# EAGLE design mLRS-tx-dualE28-top-v042 (EAGLE 7.5.0)
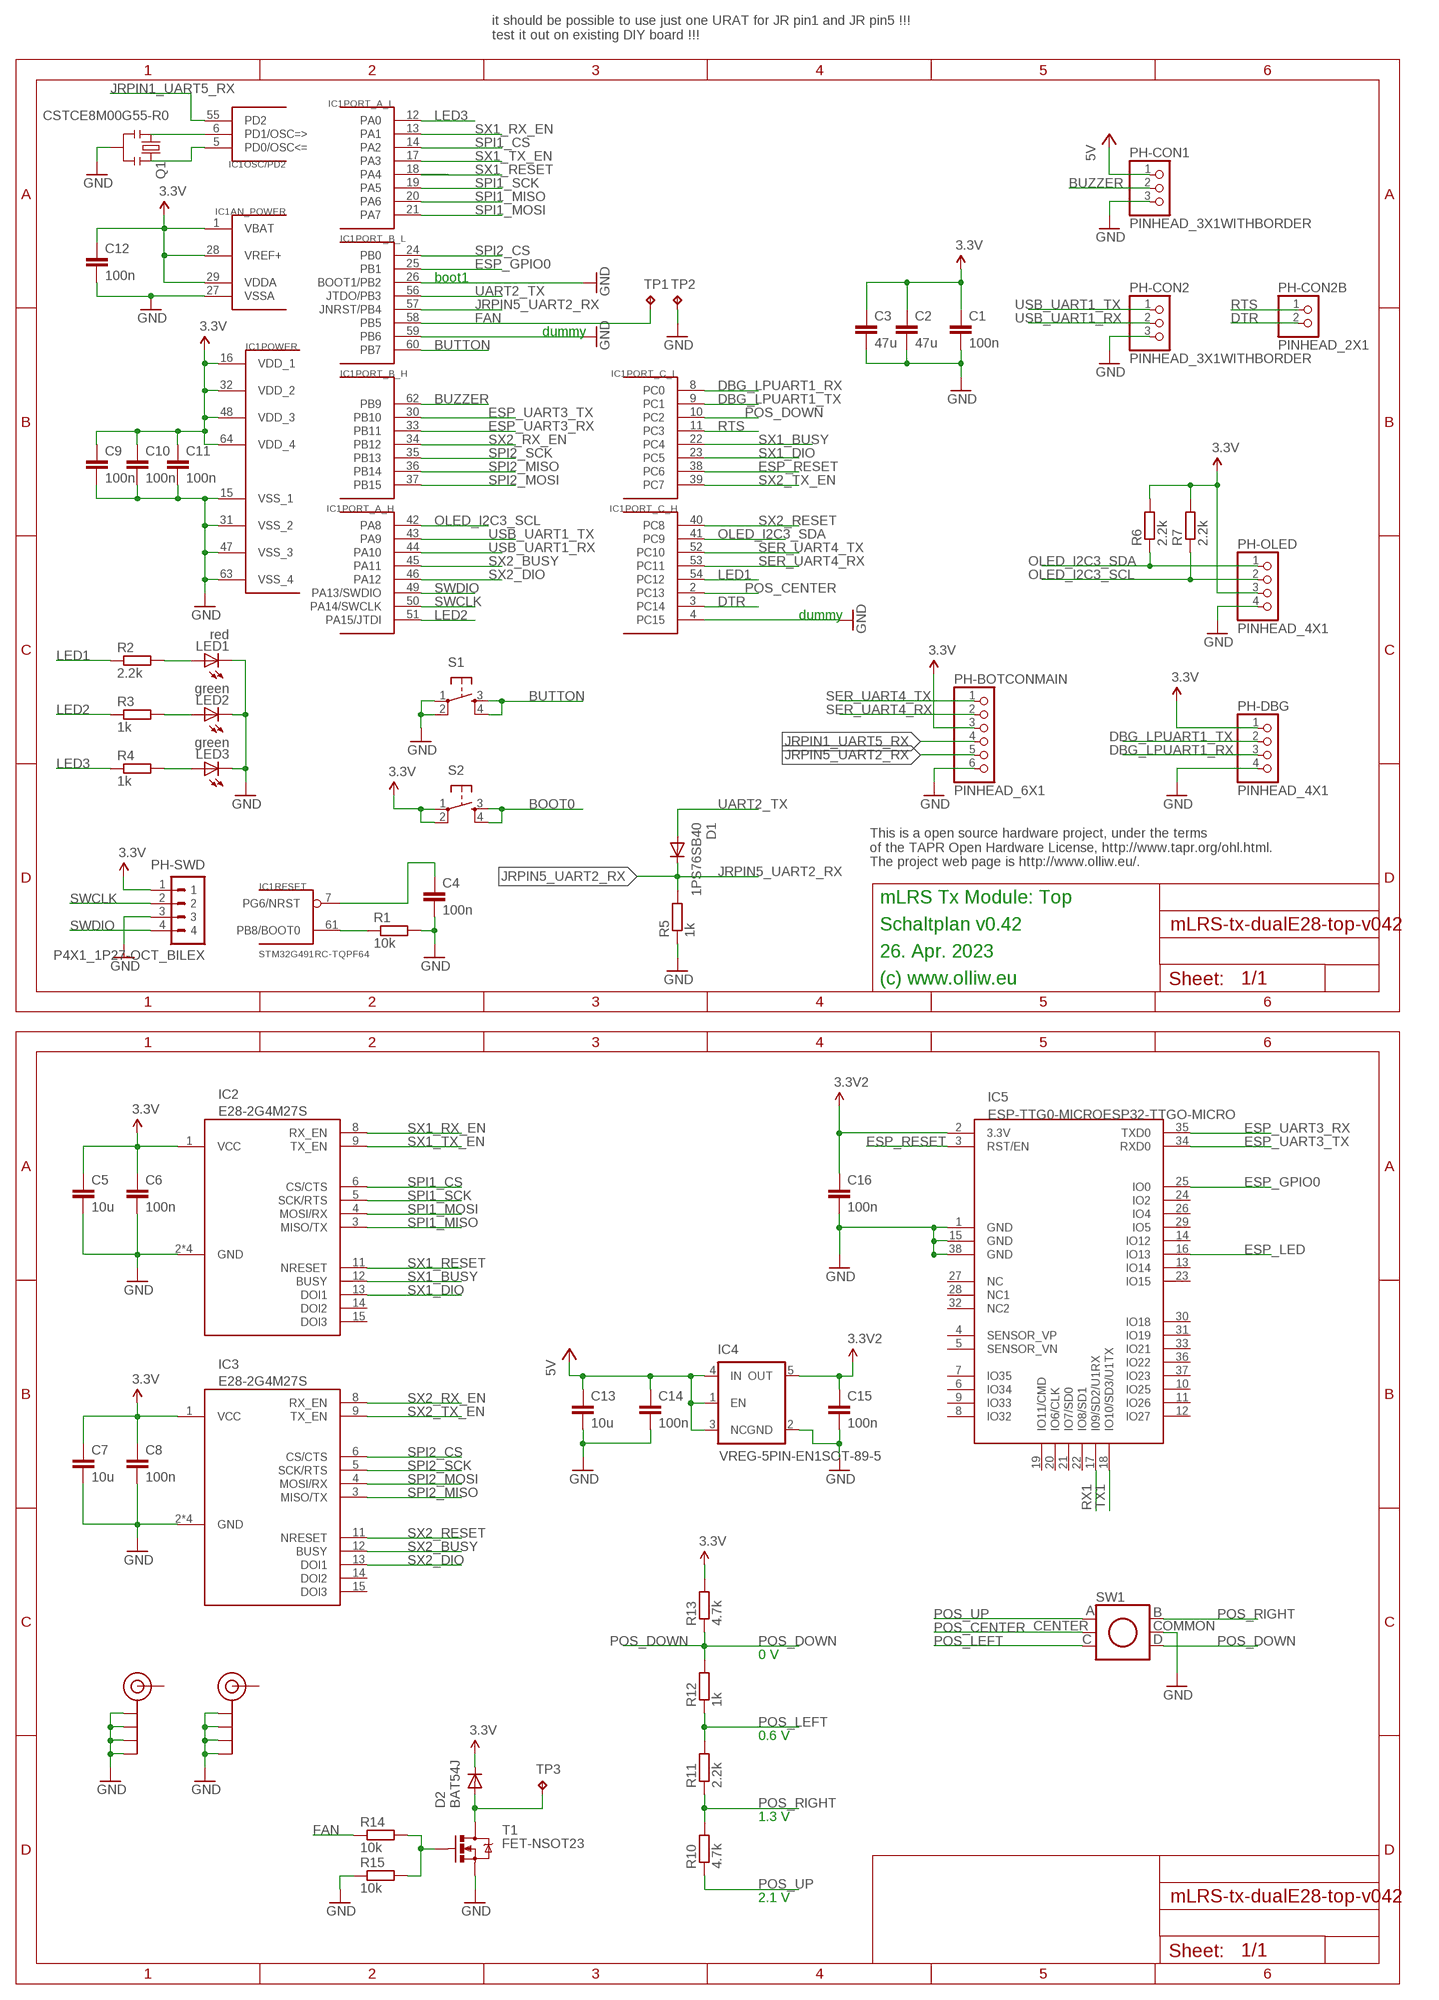
[diagram p0: schematic, sheet 1]

## Parts
C1  100n  C-EUC0402  [C0402]
C2  47u  C-EUC1210  [C1210]
C3  47u  C-EUC1206K  [C1206K]
C4  100n  C-EUC0402  [C0402]
C5  10u  C-EUC0603  [C0603]
C6  100n  C-EUC0402  [C0402]
C7  10u  C-EUC0603  [C0603]
C8  100n  C-EUC0402  [C0402]
C9  100n  C-EUC0402  [C0402]
C10  100n  C-EUC0402  [C0402]
C11  100n  C-EUC0402  [C0402]
C12  100n  C-EUC0402  [C0402]
C13  10u  C-EUC0603  [C0603]
C14  100n  C-EUC0402  [C0402]
C15  100n  C-EUC0402  [C0402]
C16  100n  C-EUC0603  [C0603]
D1  1PS76SB40  DIODE-SOD110-R  [SOD110-R]
D2  BAT54J  DIODE-SOD110-R  [SOD110-R]
IC1  STM32G491RC-TQPF64  STM32G4X1RX-TQPF64  [TQFP64]
IC2  E28-2G4M27S  E28  [E28-2G4M27]
IC3  E28-2G4M27S  E28  [E28-2G4M27]
IC4  VREG-5PIN-EN1SOT-89-5  [SOT-89-5]
IC5  ESP-TTG0-MICROESP32-TTGO-MICRO  [ESP32-TTGO-MICRO]
LED1  red  LEDCHIPLED_0603  [CHIPLED_0603]
LED2  green  LEDCHIPLED_0603  [CHIPLED_0603]
LED3  green  LEDCHIPLED_0603  [CHIPLED_0603]
PH-BOTCONMAIN  PINHEAD_6X1  [PINHEAD_6X1]
PH-CON1  PINHEAD_3X1WITHBORDER  [PINHEAD_3X1]
PH-CON2  PINHEAD_3X1WITHBORDER  [PINHEAD_3X1]
PH-CON2B  PINHEAD_2X1  [PINHEAD_2X1]
PH-DBG  PINHEAD_4X1  [PINHEAD_4X1]
PH-OLED  PINHEAD_4X1  [PINHEAD_4X1]
PH-SWD  P4X1_1P27-OCT_BILEX  [4X1_1P27_OCT_BILEX]
Q1  CSTCE8M00G55-R0  RESONATORSMD  [RESONATOR-SMD]
R1  10k  R-EU_R0402  [R0402]
R2  2.2k  R-EU_R0402  [R0402]
R3  1k  R-EU_R0402  [R0402]
R4  1k  R-EU_R0402  [R0402]
R5  1k  R-EU_R0402  [R0402]
R6  2.2k  R-EU_R0402  [R0402]
R7  2.2k  R-EU_R0402  [R0402]
R10  4.7k  R-EU_R0402  [R0402]
R11  2.2k  R-EU_R0402  [R0402]
R12  1k  R-EU_R0402  [R0402]
R13  4.7k  R-EU_R0402  [R0402]
R14  10k  R-EU_R0402  [R0402]
R15  10k  R-EU_R0402  [R0402]
RF1  SMA_EDGE  [SMA-EDGE]
RF2  SMA_EDGE  [SMA-EDGE]
S1  TAC_SWITCHPTH  [TACTILE-PTH]
S2  TAC_SWITCHPTH  [TACTILE-PTH]
SW1  JOYSTICK-5WAY  [JOYSTICK-5WAY]
T1  FET-NSOT23  [SOT23]
TP1  TPB1,27  [B1,27]
TP2  TPB1,27  [B1,27]
TP3  TPB1,27  [B1,27]

## Nets
2.8V: C15.1 C16.1 IC4.5(OUT) IC5.2(3.3V) ; supply symbol labelled 3.3V2
3.3V: C1.1 C2.1 C3.1 C5.1 C6.1 C7.1 C8.1 C9.1 C10.1 C11.1 C12.1 D2.C IC1.1(AN_POWER:VBAT) IC1.16(POWER:VDD_1) IC1.28(AN_POWER:VREF+) IC1.29(AN_POWER:VDDA) IC1.32(POWER:VDD_2) IC1.48(POWER:VDD_3) IC1.64(POWER:VDD_4) IC2.1(VCC) IC3.1(VCC) PH-BOTCONMAIN.3 PH-DBG.1 PH-OLED.3 PH-SWD.1 R6.2 R7.2 R13.2 S2.1 S2.2
5V: C13.1 C14.1 IC4.1(EN) IC4.3(NC) IC4.4(IN) PH-CON1.1
BOOT0: IC1.61(RESET:PB8/BOOT0) R1.1 S2.3 S2.4
BUTTON: IC1.60(PORT_B_L:PB7) S1.3 S1.4
BUZ-: D2.A T1.3(D) TP3.TP
BUZZER: IC1.62(PORT_B_H:PB9) PH-CON1.2
DBG_LPUART1_RX: IC1.8(PORT_C_L:PC0) PH-DBG.3
DBG_LPUART1_TX: IC1.9(PORT_C_L:PC1) PH-DBG.2
DTR: IC1.3(PORT_C_H:PC14) PH-CON2B.2
ESP_GPIO0: IC1.25(PORT_B_L:PB1) IC5.25(IO0)
ESP_LED: IC5.16(IO13)
ESP_RESET: IC1.38(PORT_C_L:PC6) IC5.3(RST/EN)
ESP_UART3_RX: IC1.33(PORT_B_H:PB11) IC5.35(TXD0)
ESP_UART3_TX: IC1.30(PORT_B_H:PB10) IC5.34(RXD0)
FAN: IC1.58(PORT_B_L:PB5) R14.1 TP1.TP
GND: C1.2 C2.2 C3.2 C4.2 C5.2 C6.2 C7.2 C8.2 C9.2 C10.2 C11.2 C12.2 C13.2 C14.2 C15.2 C16.2 IC1.4(PORT_C_H:PC15) IC1.15(POWER:VSS_1) IC1.26(PORT_B_L:BOOT1/PB2) IC1.27(AN_POWER:VSSA) IC1.31(POWER:VSS_2) IC1.47(POWER:VSS_3) IC1.59(PORT_B_L:PB6) IC1.63(POWER:VSS_4) IC2.2(GND) IC2.7(GND) IC2.10(GND) IC2.16(GND) IC3.2(GND) IC3.7(GND) IC3.10(GND) IC3.16(GND) IC4.2(GND) IC5.1(GND) IC5.15(GND) IC5.38(GND) LED1.C LED2.C LED3.C PH-BOTCONMAIN.6 PH-CON1.3 PH-CON2.3 PH-DBG.4 PH-OLED.4 PH-SWD.3 Q1.2 R1.2 R5.1 R15.1 RF1.GND@0(GND) RF1.GND@1(GND) RF1.GND@2(GND) RF1.GND@3(GND) RF2.GND@0(GND) RF2.GND@1(GND) RF2.GND@2(GND) RF2.GND@3(GND) S1.1 S1.2 SW1.5(COMMON) T1.2(S) TP2.TP
JRPIN1_UART5_RX: IC1.55(OSC/PD2:PD2) PH-BOTCONMAIN.4
JRPIN5_UART2_RX: D1.C IC1.57(PORT_B_L:JNRST/PB4) PH-BOTCONMAIN.5 R5.2
LED1: IC1.54(PORT_C_H:PC12) R2.1
LED2: IC1.51(PORT_A_H:PA15/JTDI) R3.1
LED3: IC1.12(PORT_A_L:PA0) R4.1
N$2: R14.2 R15.2 T1.1(G)
N$4: LED1.A R2.2
N$5: C4.1 IC1.7(RESET:PG6/NRST)
N$8: LED2.A R3.2
N$9: LED3.A R4.2
N$12: IC1.5(OSC/PD2:PD0/OSC<=) Q1.3
N$14: IC1.6(OSC/PD2:PD1/OSC=>) Q1.1
OLED_I2C3_SCL: IC1.42(PORT_A_H:PA8) PH-OLED.2 R7.1
OLED_I2C3_SDA: IC1.41(PORT_C_H:PC9) PH-OLED.1 R6.1
POS_CENTER: IC1.2(PORT_C_H:PC13) SW1.2(CENTER)
POS_DOWN: IC1.10(PORT_C_L:PC2) R12.2 R13.1 SW1.6(D)
POS_LEFT: R11.2 R12.1 SW1.3(C)
POS_RIGHT: R10.2 R11.1 SW1.4(B)
POS_UP: R10.1 SW1.1(A)
RTS: IC1.11(PORT_C_L:PC3) PH-CON2B.1
RX1: IC5.17(I09/SD2/U1RX)
SER_UART4_RX: IC1.53(PORT_C_H:PC11) PH-BOTCONMAIN.2
SER_UART4_TX: IC1.52(PORT_C_H:PC10) PH-BOTCONMAIN.1
SPI1_CS: IC1.14(PORT_A_L:PA2) IC2.6(CS/CTS)
SPI1_MISO: IC1.20(PORT_A_L:PA6) IC2.3(MISO/TX)
SPI1_MOSI: IC1.21(PORT_A_L:PA7) IC2.4(MOSI/RX)
SPI1_SCK: IC1.19(PORT_A_L:PA5) IC2.5(SCK/RTS)
SPI2_CS: IC1.24(PORT_B_L:PB0) IC3.6(CS/CTS)
SPI2_MISO: IC1.36(PORT_B_H:PB14) IC3.3(MISO/TX)
SPI2_MOSI: IC1.37(PORT_B_H:PB15) IC3.4(MOSI/RX)
SPI2_SCK: IC1.35(PORT_B_H:PB13) IC3.5(SCK/RTS)
SWCLK: IC1.50(PORT_A_H:PA14/SWCLK) PH-SWD.2
SWDIO: IC1.49(PORT_A_H:PA13/SWDIO) PH-SWD.4
SX1_BUSY: IC1.22(PORT_C_L:PC4) IC2.12(BUSY)
SX1_DIO: IC1.23(PORT_C_L:PC5) IC2.13(DOI1)
SX1_RESET: IC1.18(PORT_A_L:PA4) IC2.11(NRESET)
SX1_RX_EN: IC1.13(PORT_A_L:PA1) IC2.8(RX_EN)
SX1_TX_EN: IC1.17(PORT_A_L:PA3) IC2.9(TX_EN)
SX2_BUSY: IC1.45(PORT_A_H:PA11) IC3.12(BUSY)
SX2_DIO: IC1.46(PORT_A_H:PA12) IC3.13(DOI1)
SX2_RESET: IC1.40(PORT_C_H:PC8) IC3.11(NRESET)
SX2_RX_EN: IC1.34(PORT_B_H:PB12) IC3.8(RX_EN)
SX2_TX_EN: IC1.39(PORT_C_L:PC7) IC3.9(TX_EN)
TX1: IC5.18(IO10/SD3/U1TX)
UART2_TX: D1.A IC1.56(PORT_B_L:JTDO/PB3)
USB_UART1_RX: IC1.44(PORT_A_H:PA10) PH-CON2.2
USB_UART1_TX: IC1.43(PORT_A_H:PA9) PH-CON2.1
Unconnected: IC2.14(DOI2) IC2.15(DOI3) IC3.14(DOI2) IC3.15(DOI3) IC5.4(SENSOR_VP) IC5.5(SENSOR_VN) IC5.6(IO34) IC5.7(IO35) IC5.8(IO32) IC5.9(IO33) IC5.10(IO25) IC5.11(IO26) IC5.12(IO27) IC5.13(IO14) IC5.14(IO12) IC5.19(IO11/CMD) IC5.20(IO6/CLK) IC5.21(IO7/SD0) IC5.22(IO8/SD1) IC5.23(IO15) IC5.24(IO2) IC5.26(IO4) IC5.27(NC) IC5.28(NC1) IC5.29(IO5) IC5.30(IO18) IC5.31(IO19) IC5.32(NC2) IC5.33(IO21) IC5.36(IO22) IC5.37(IO23) RF1.SIG(SIGNAL) RF2.SIG(SIGNAL)

## Notes on the sheet
- it should be possible to use just one URAT for JR pin1 and JR pin5 !!!
  test it out on existing DIY board !!!
- boot1
- dummy
- dummy
- This is a open source hardware project, under the terms
  of the TAPR Open Hardware License, http://www.tapr.org/ohl.html.
  The project web page is http://www.olliw.eu/.
- mLRS Tx Module: Top
- Schaltplan v0.42
- 26. Apr. 2023
- (c) www.olliw.eu
- 0 V
- 0.6 V
- 1.3 V
- 2.1 V

## Library data of the parts
C1-C16 = rcl:C-EU: CAPACITOR, European symbol
D1 D2 = diode:DIODE-: DIODE
IC1 = # stm32:STM32G4X1RX
IC2 IC3 = # stdlib:E28
IC4 = # stdlib:VREG-5PIN-EN1
IC5 = # stdlib:ESP-TTG0-MICRO
LED1-LED3 = led:LED: LED OSRAM: - CHIPLED LG R971, LG N971, LY N971, LG Q971, LY Q971, LO R971, LY R971 LH N974, LH R974 LS Q976, LO Q976, LY Q976 LO Q996 - Hyper CHIPLED LW Q18S LB Q993, LB Q99A, LB R99A - SideLED LS A670, LO A670, LY A670, LG A670, LP A670 LB A673, LV A673, LT A673, LW A673 LH A674 LY A675 LS A676, LA A676, LO A676, LY A676, LW A676 LS A679, LY A679, LG A679 - Hyper Micro SIDELED® LS Y876, LA Y876, LO Y876, LY Y876 LT Y87S - SmartLED LW L88C, LW L88S LB L89C, LB L89S, LG L890 LS L89K, LO L89K, LY L89K LS L896, LA L896, LO L896, LY L896 - TOPLED LS T670, LO T670, LY T670, LG T670, LP T670 LSG T670, LSP T670, LSY T670, LOP T670, LYG T670 LG T671, LOG T671, LSG T671 LB T673, LV T673, LT T673, LW T673 LH T674 LS T676, LA T676, LO T676, LY T676, LB T676, LH T676, LSB T676, LW T676 LB T67C, LV T67C, LT T67C, LS T67K, LO T67K, LY T67K, LW E67C LS E67B, LA E67B, LO E67B, LY E67B, LB E67C, LV E67C, LT E67C LW T67C LS T679, LY T679, LG T679 LS T770, LO T770, LY T770, LG T770, LP T770 LB T773, LV T773, LT T773, LW T773 LH T774 LS E675, LA E675, LY E675, LS T675 LS T776, LA T776, LO T776, LY T776, LB T776 LHGB T686 LT T68C, LB T68C - Hyper Mini TOPLED® LB M676 - Mini TOPLED Santana® LG M470 LS M47K, LO M47K, LY M47K Source: http://www.osram.convergy.de LUXEON: - LUMILED® LXK2-PW12-R00, LXK2-PW12-S00, LXK2-PW14-U00, LXK2-PW14-V00 LXK2-PM12-R00, LXK2-PM12-S00, LXK2-PM14-U00 LXK2-PE12-Q00, LXK2-PE12-R00, LXK2-PE12-S00, LXK2-PE14-T00, LXK2-PE14-U00 LXK2-PB12-K00, LXK2-PB12-L00, LXK2-PB12-M00, LXK2-PB14-N00, LXK2-PB14-P00, LXK2-PB14-Q00 LXK2-PR12-L00, LXK2-PR12-M00, LXK2-PR14-Q00, LXK2-PR14-R00 LXK2-PD12-Q00, LXK2-PD12-R00, LXK2-PD12-S00 LXK2-PH12-R00, LXK2-PH12-S00 LXK2-PL12-P00, LXK2-PL12-Q00, LXK2-PL12-R00 Source: www.luxeon.com KINGBRIGHT: KA-3528ASYC Source: www.kingbright.com
PH-BOTCONMAIN = # stdlib:PINHEAD_6X1
PH-CON1 PH-CON2 = # stdlib:PINHEAD_3X1
PH-CON2B = # stdlib:PINHEAD_2X1
PH-DBG PH-OLED = # stdlib:PINHEAD_4X1
PH-SWD = # stdlib:P4X1_1P27
Q1 = # SparkFun2:RESONATOR: Resonator Small SMD resonator. This is the itty bitty 10/20MHz resonators with built in caps. CSTCE10M0G55 and CSTCE20M0V53. Footprint has been reviewed closely but hasn't been tested yet.
R1-R7 R10-R15 = rcl:R-EU_: RESISTOR, European symbol
RF1 RF2 = # SparkFun2:SMA_EDGE: SMA Antenna Connector End launch SMA connector. The paste layer has been removed so that the connector can be hand soldered onto the board after reflow.
S1 S2 = # SparkFun2:TAC_SWITCH: Momentary Switch Button commonly used for reset or general input. Spark Fun Electronics SKU : COM-00097
SW1 = # stdlib:JOYSTICK-5WAY
T1 = # stdlib:FET-N
TP1-TP3 = testpad:TP: Test pad

## Board
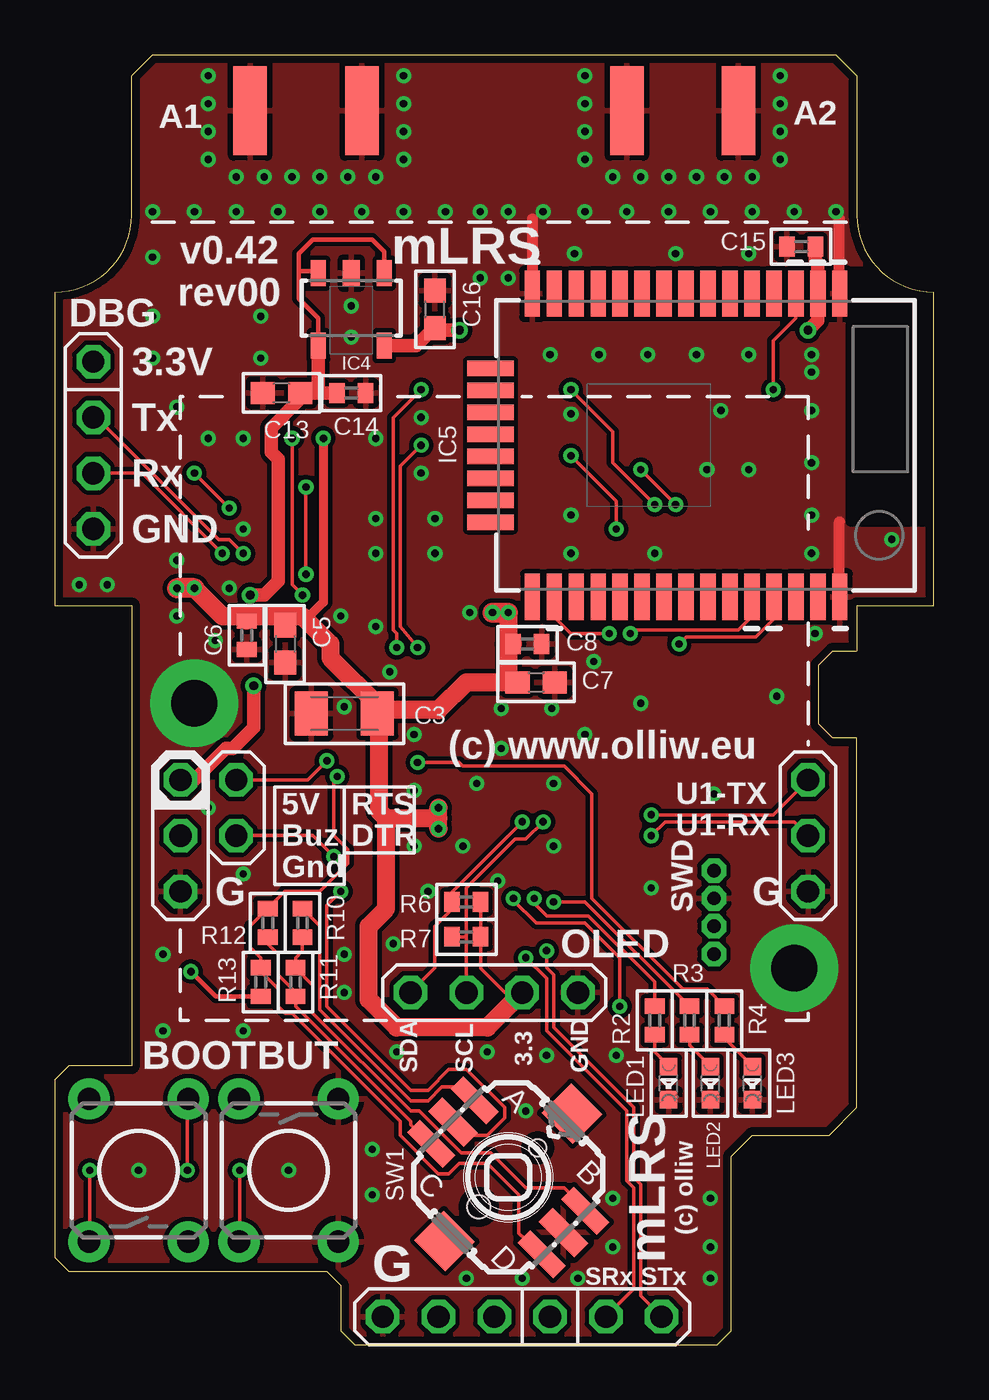
[diagram p1: board, top side]
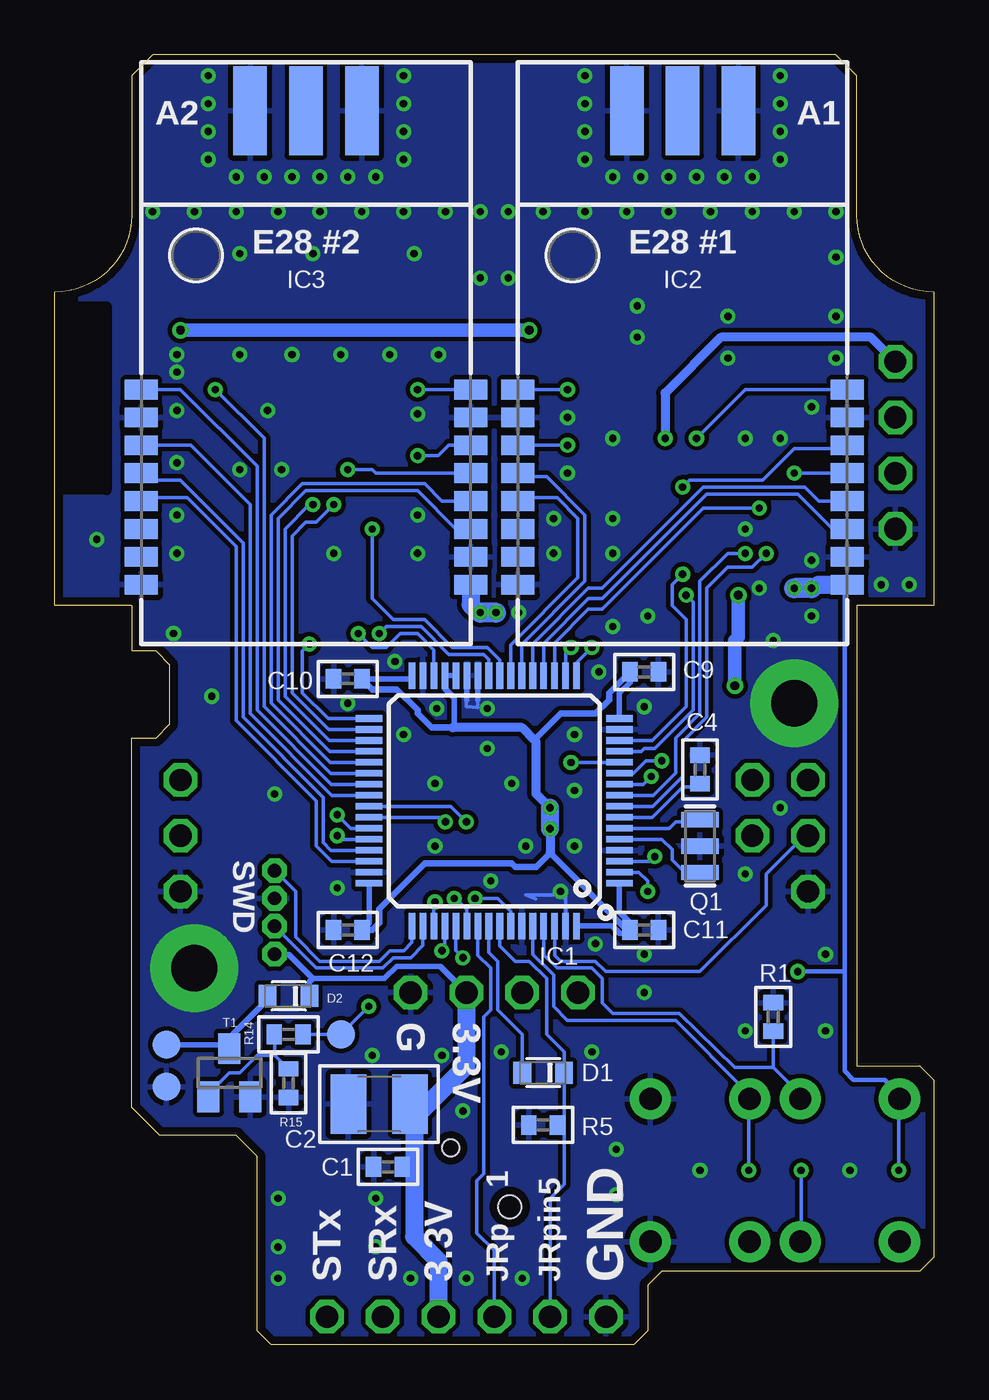
[diagram p2: board, bottom side, seen from below]

Size 40.01 x 58.74 mm. Coordinates in mm from the lower left corner, seen from the top.
Outline: 36.51,10.79 36.51,27.62 35.4,27.62 34.77,28.26 34.77,30.96 35.4,31.59 36.51,31.59 36.51,33.66 40.01,33.66 40.01,47.94 arc-90 36.51,51.44 36.51,57.78 35.56,58.74 4.45,58.74 3.49,57.78 3.49,51.44 arc-90 0,47.94 0,33.66 3.49,33.66 3.49,12.7 0.64,12.7 0,12.07 0,3.97 0.64,3.33 12.38,3.33 13.02,2.7 13.02,0.63 13.65,0 30.16,0 30.8,0.63 30.8,8.57 31.75,9.53 35.24,9.53 36.51,10.79
Copper layers (1*16): Top 0.0356mm / dielectric 1.5011mm / Bottom 0.0356mm
Design rules "ow-oshpark-2layer": minimum track width 6mil, minimum drill 13mil, track to track 6mil, track to pad 6mil, pad to pad 6mil, via to via 6mil, smd to smd 6mil, copper to edge 15mil, drill to drill 6mil, minimum pad ring 7mil, minimum via ring 7mil, stop-mask expansion 2.5mil, vias tented up to drill 26mil, thermal gap 10mil
tRestrict: area 36.2,37.5 to 40.6,48.9
bRestrict: area 37.6,38.9 to 41.3,47.3

### Footprints (pad centres in the part's own frame; a part is rotated, then mirrored left to right if it is on the bottom)
C0402 = smd 0.7 x 0.9: 1 -0.65,0; 2 0.65,0
C1210 = smd 1.6 x 2.7: 1 -1.4,0; 2 1.4,0
C1206K = smd 1.5 x 2: 1 -1.5,0; 2 1.5,0
C0603 = smd 1.1 x 1: 1 -0.85,0; 2 0.85,0
SOD110-R = smd 0.8 x 1: A 0.95,0; C -0.95,0
TQFP64 = smd 1.2 x 0.3: 1 -5.7,3.75; 2 -5.7,3.25; 3 -5.7,2.75; 4 -5.7,2.25; 5 -5.7,1.75; 6 -5.7,1.25; 7 -5.7,0.75; 8 -5.7,0.25; 9 -5.7,-0.25; 10 -5.7,-0.75; 11 -5.7,-1.25; 12 -5.7,-1.75; 13 -5.7,-2.25; 14 -5.7,-2.75; 15 -5.7,-3.25; 16 -5.7,-3.75; 33 5.7,-3.75; 34 5.7,-3.25; 35 5.7,-2.75; 36 5.7,-2.25; 37 5.7,-1.75; 38 5.7,-1.25; 39 5.7,-0.75; 40 5.7,-0.25; 41 5.7,0.25; 42 5.7,0.75; 43 5.7,1.25; 44 5.7,1.75; 45 5.7,2.25; 46 5.7,2.75; 47 5.7,3.25; 48 5.7,3.75 | smd 0.3 x 1.2: 17 -3.75,-5.7; 18 -3.25,-5.7; 19 -2.75,-5.7; 20 -2.25,-5.7; 21 -1.75,-5.7; 22 -1.25,-5.7; 23 -0.75,-5.7; 24 -0.25,-5.7; 25 0.25,-5.7; 26 0.75,-5.7; 27 1.25,-5.7; 28 1.75,-5.7; 29 2.25,-5.7; 30 2.75,-5.7; 31 3.25,-5.7; 32 3.75,-5.7; 49 3.75,5.7; 50 3.25,5.7; 51 2.75,5.7; 52 2.25,5.7; 53 1.75,5.7; 54 1.25,5.7; 55 0.75,5.7; 56 0.25,5.7; 57 -0.25,5.7; 58 -0.75,5.7; 59 -1.25,5.7; 60 -1.75,5.7; 61 -2.25,5.7; 62 -2.75,5.7; 63 -3.25,5.7; 64 -3.75,5.7
E28-2G4M27 = smd 1.5 x 0.9: 1 7.5,0; 2 7.5,1.27; 3 7.5,2.54; 4 7.5,3.81; 5 7.5,5.08; 6 7.5,6.35; 7 7.5,7.62; 8 7.5,8.89; 9 -7.5,8.89; 10 -7.5,7.62; 11 -7.5,6.35; 12 -7.5,5.08; 13 -7.5,3.81; 14 -7.5,2.54; 15 -7.5,1.27; 16 -7.5,0
SOT-89-5 = smd 0.68 x 1.2: 1 -1.5,-1.65; 3 1.5,-1.65; 4 1.5,1.65; 5 -1.5,1.65 | smd 0.76 x 1.2: 2 0,-1.65
ESP32-TTGO-MICRO = smd 2.1 x 0.7: 1 -6.9,7; 2 -6.9,6; 3 -6.9,5; 4 -6.9,4; 5 -6.9,3; 6 -6.9,2; 7 -6.9,1; 8 -6.9,0; 9 -6.9,-1; 10 -6.9,-2; 11 -6.9,-3; 12 -6.9,-4; 13 -6.9,-5; 14 -6.9,-6; 15 -6.9,-7; 24 6.9,-7; 25 6.9,-6; 26 6.9,-5; 27 6.9,-4; 28 6.9,-3; 29 6.9,-2; 30 6.9,-1; 31 6.9,0; 32 6.9,1; 33 6.9,2; 34 6.9,3; 35 6.9,4; 36 6.9,5; 37 6.9,6; 38 6.9,7 | smd 0.7 x 2.1: 16 -3.5,-8.9; 17 -2.5,-8.9; 18 -1.5,-8.9; 19 -0.5,-8.9; 20 0.5,-8.9; 21 1.5,-8.9; 22 2.5,-8.9; 23 3.5,-8.9
CHIPLED_0603 = smd 0.8 x 0.8: A 0,-0.75; C 0,0.75
PINHEAD_6X1 = drill 1.016 octagon: 1 0,12.7; 2 0,10.16; 3 0,7.62; 4 0,5.08; 5 0,2.54; 6 0,0
PINHEAD_3X1 = drill 1.016 octagon: 1 0,0; 2 0,-2.54; 3 0,-5.08
PINHEAD_2X1 = drill 1.016 octagon: 1 0,0; 2 0,-2.54
PINHEAD_4X1 = drill 1.016 octagon: 1 0,7.62; 2 0,5.08; 3 0,2.54; 4 0,0
4X1_1P27_OCT_BILEX = drill 0.61 pad 1.118 octagon: 1 0,0; 2 0,-1.27; 3 0,-2.54; 4 0,-3.81
RESONATOR-SMD = smd 0.7 x 1.7: 1 -1.2,0; 2 0,0; 3 1.2,0
R0402 = smd 0.7 x 0.9: 1 -0.65,0; 2 0.65,0
SMA-EDGE = smd 1.524 x 4.064: GND@0 0,0; GND@1 5.08,0; SIG 2.54,0 | smd 1.524 x 4.064 bottom: GND@2 0,0; GND@3 5.08,0
TACTILE-PTH = drill 1.016 pad 1.88: 1 -3.251,2.261; 2 3.251,2.261; 3 -3.251,-2.261; 4 3.251,-2.261
JOYSTICK-5WAY = smd 2.286 x 0.813: 1 -3.556,1.4; 3 -3.556,-1.4; 4 3.556,1.4; 6 3.556,-1.4 | smd 2.286 x 0.914: 2 -3.556,0; 5 3.556,0 | smd 2 x 1.9: S 0,4.1; T 0,-4.1 | hole 0.75: 0,1.9 | hole 1.05: 0,-1.9
SOT23 = smd 1 x 1.4: 1 -0.95,-1.1; 2 0.95,-1.1; 3 0,1.1
B1,27 = smd 1.27 x 1.27: TP 0,0

### Placement (x,y rotation side)
C1  24.84,8.1 180 bottom
C2  25.24,10.95 180 bottom
C3  13.18,28.73 180 top
C4  10.64,26.19 90 bottom
C5  10.48,31.91 270 top
C6  8.73,32.31 270 top
C7  21.91,30.16 0 top
C8  21.51,31.91 0 top
C9  13.18,30.64 0 bottom
C10  26.67,30.32 180 bottom
C11  13.18,18.89 0 bottom
C12  26.67,18.89 180 bottom
C13  10.32,43.34 180 top
C14  13.49,43.34 0 top
C15  33.97,50.01 180 top
C16  17.3,47.15 90 top
D1  17.78,12.38 180 bottom
D2  29.37,15.88 180 bottom
IC1  20,24.77 180 bottom
IC2  11.43,34.61 0 bottom
IC3  28.57,34.61 0 bottom
IC4  13.49,47.15 180 top
IC5  28.73,40.96 270 top
LED1  27.94,11.91 180 top
LED2  29.84,11.91 180 top
LED3  31.75,11.91 180 top
PH-BOTCONMAIN  14.92,1.27 270 top
PH-CON1  5.71,25.72 0 top
PH-CON2  34.29,25.72 0 top
PH-CON2B  8.26,25.72 0 top
PH-DBG  1.75,37.15 0 top
PH-OLED  23.81,16.03 90 top
PH-SWD  30,17.78 180 top
Q1  10.64,22.7 270 bottom
R1  7.3,14.92 90 bottom
R2  27.3,14.76 270 top
R3  28.89,14.76 270 top
R4  30.48,14.76 270 top
R5  17.78,10 0 bottom
R6  18.73,20.16 0 top
R7  18.73,18.57 0 top
R10  11.27,19.21 270 top
R11  10.95,16.51 270 top
R12  9.68,19.21 90 top
R13  9.37,16.51 270 top
R14  29.37,14.13 180 bottom
R15  29.37,11.91 90 bottom
RF1  13.97,56.2 0 bottom
RF2  31.11,56.2 0 bottom
S1  10.64,7.94 270 top
S2  3.81,7.94 90 top
SW1  20.64,7.62 315 top
T1  32.07,12.38 0 bottom
TP1  26.99,14.13 0 bottom
TP2  34.93,11.75 0 bottom
TP3  34.93,13.65 0 bottom

### Tracks (layer width: path | path; a pad name or v marks a point on that pad's centre or on a via)
2.8V  (via drill 0.4)
  Top 0.61: v34.29,46.2 34.73,46.64 IC5.2 34.73,49.24 34.61,49.37 34.61,49.99 C15.1 | IC4.5 16.45,45.5 16.99,46.04 17.04,46.04 C16.1 17.3,46.2 v18.41,46.2
  Bottom 0.61: v18.41,46.2 v34.29,46.2
3.3V  (via drill 0.33)
  Top 0.152: PH-OLED.3 20.48,16.03 19.38,17.13 R7.2 R6.2 | v1.59,7.94 1.59,4.72 S2.1
  Top 0.203: R13.2 7.32,15.86 v6.19,16.99
  Top 0.406: 10.48,32.92 C5.1 | v12.22,41.27 12.22,33.81 11.43,33.02
  Top 0.61: C3.1 14.52,28.65 14.76,29.05
  Top 0.813: PH-OLED.3 19.68,14.45 15.56,14.45 14.29,15.72 14.29,19.05 15.08,19.84 15.08,23.97 | 15.08,23.97 14.76,24.29 14.76,29.05 | 14.76,29.05 14.62,28.73 14.78,28.89 17.46,28.89 18.73,30.16 20.64,30.16 | 17.46,23.97 v17.46,24.45 | 8.89,33.18 7.62,33.18 v6.35,34.45 | 8.89,33.18 10.48,33.18 | 10.48,33.18 11.27,33.18 11.43,33.02 12.54,31.91 12.54,31.27 14.76,29.05 | C6.1 8.89,33.18 | C5.1 10.48,33.18 | v20.64,33.34 20.64,31.91 | 20.64,31.91 20.64,30.16 | C7.1 20.64,30.16 | C8.1 20.64,31.91 | v17.46,23.5 17.46,23.97 | 17.46,23.97 15.08,23.97
  Top 0.914: v6.35,34.45 v5.56,34.45 | v19.92,33.34 v20.64,33.34
  Bottom 0.152: S2.2 1.55,11.15 1.59,11.11 | 1.59,11.11 v1.59,7.94 | 1.59,11.11 1.59,11.43 | 4.05,34.49 IC2.1
  Bottom 0.203: 1.59,11.43 2.22,12.07 3.65,12.07 4.05,12.46 4.05,16.99 | 4.05,16.99 4.05,34.49 | v6.19,16.99 4.05,16.99
  Bottom 0.254: IC1.1 14.3,19.7 13.81,19.21 13.81,18.88 C11.1 13.97,18.73 14.29,18.73 14.62,19.07 IC1.64 | IC1.48 25.7,19.21 C12.1 | PH-SWD.1 29.37,17.78 28.26,16.67 | 28.26,16.67 25,16.67 24.45,17.22 22.46,17.22 PH-OLED.3 | 13.81,30.64 13.83,30.65 C9.1 13.81,30.78 13.81,30.16 14.3,29.67 IC1.16 | 21.91,28.1 21.83,28.18 21.83,29.45 22.25,29.87 IC1.29 IC1.28 | IC1.32 23.75,30.38 23.81,30.32 C10.1 | D2.C 28.42,16.51 28.26,16.67
  Bottom 0.305: C9.1 13.97,30.48 14.76,29.69 14.76,29.37 15.4,28.73 16.99,28.73 18.18,27.54 | C10.1 26.02,30.31 25.56,29.84 24.45,29.84 23.49,28.89 23.49,28.73 22.86,28.1 21.91,28.1 | C12.1 25.56,18.89 25.24,19.21 25.24,19.84 23.18,21.91 19.21,21.91 19.05,21.75 18.1,21.75 17.46,22.38 13.81,18.73 C11.1
  Bottom 0.406: PH-DBG.1 2.86,45.88 9.68,45.88 12.22,43.34 v12.22,41.27 | v17.46,23.5 17.46,22.38 | v17.46,24.45 18.1,25.08 18.1,27.46 18.18,27.54 18.73,28.1 21.91,28.1
  Bottom 0.61: C2.1 23.97,10.95 23.65,10.32 | C1.1 23.65,8.25
  Bottom 0.813: PH-OLED.3 21.27,12.7 23.65,10.32 23.65,8.25 23.65,4.92 22.54,3.81 PH-BOTCONMAIN.3 | v17.46,23.5 v17.46,24.45 | v5.56,34.45 5.24,34.61 IC2.1 | IC3.1 21.07,33.69 20.72,33.34 20.52,33.38 v19.92,33.34
  Bottom 0.914: v5.56,34.45 v6.35,34.45 | v19.92,33.34 v20.64,33.34
5V  (via drill 0.4)
  Top 0.203: IC4.1 14.99,49.78 14.45,50.32 11.75,50.32 11.11,49.69 11.11,48.9 | 11.11,48.9 11.11,47.62 11.99,46.74 IC4.4 | IC4.3 11.99,48.82 12.06,48.9 11.11,48.9
  Top 0.61: PH-CON1.1 6.35,25.72 7.78,27.15 8.1,27.15 9.05,28.1 v9.05,30 | v8.89,34.13 9.53,34.13 10.16,34.77 10.16,40.32 9.84,40.64 9.84,41.75 11.11,43.02 11.11,43.28 C13.1 11.91,43.34 | 11.91,43.34 C14.1 | IC4.4 11.99,43.43 11.91,43.34
  Bottom 0.61: v9.05,30 9.05,32.07 8.89,32.23 v8.89,34.13
BOOT0  (via drill 0.33)
  Top 0.152: S2.4 6.07,11.15 6.03,11.11 v6.03,7.94
  Bottom 0.152: IC1.61 17.75,17.75 17.14,17.14 15.56,17.14 15.08,16.67 15.08,15.56 14.61,15.08 11.59,15.08 9.05,12.62 7.3,12.62 | v6.03,7.94 6.03,4.72 S2.3 | 7.3,12.62 R1.1 | S2.4 6.07,11.39 7.3,12.62
BUTTON  (via drill 0.33)
  Top 0.152: v8.41,7.94 8.41,4.72 S1.4
  Bottom 0.152: IC1.60 18.25,17.78 17.3,16.83 17.3,15.4 16.67,14.76 11.75,14.76 8.57,11.59 8.57,11.39 S1.3 8.38,11.15 8.41,11.11 v8.41,7.94
BUZ-
  Bottom 0.254: D2.A 30.32,15.72 31.91,14.13 31.91,13.8 T1.3 32.24,13.65 TP3.TP
BUZZER
  Bottom 0.152: IC1.62 17.25,17.73 16.99,17.46 15.4,17.46 14.92,16.99 10.64,16.99 7.62,20 7.62,21.43 5.87,23.18 PH-CON1.2
DBG_LPUART1_RX  (via drill 0.33)
  Top 0.152: PH-DBG.3 3.97,39.69 v7.62,36.04
  Bottom 0.152: v7.62,36.04 8.26,35.4 9.37,35.4 10.32,34.45 10.32,28.58 11.43,27.46 11.43,25.88 12.79,24.52 IC1.8
DBG_LPUART1_TX  (via drill 0.33)
  Top 0.152: v8.57,36.04 7.94,36.67 7.46,36.67 1.91,42.23 PH-DBG.2
  Bottom 0.152: v8.57,36.04 9.37,36.04 10.64,34.77 10.64,28.73 11.75,27.62 11.75,26.04 12.77,25.02 IC1.9
DTR  (via drill 0.33)
  Top 0.152: v12.7,22.23 11.75,23.18 PH-CON2B.2
  Bottom 0.152: IC1.3 12.91,22.02 v12.7,22.23
ESP_GPIO0  (via drill 0.33)
  Top 0.152: IC5.25 22.73,33.15 23.49,32.38 v25.24,32.38
  Bottom 0.152: IC1.25 20.25,31.21 20.48,31.43 22.07,31.43 23.34,32.7 24.92,32.7 v25.24,32.38
ESP_RESET  (via drill 0.33)
  Top 0.152: v32.7,43.5 32.7,45.72 33.73,46.75 IC5.3
  Bottom 0.152: IC1.38 27.44,26.02 30.48,29.05 30.48,41.27 v32.7,43.5
ESP_UART3_RX  (via drill 0.33)
  Top 0.152: IC5.35 32.73,33.05 31.91,32.23 28.73,32.23 v28.42,31.91
  Bottom 0.152: v28.42,31.91 28.73,31.59 28.73,29.69 27.56,28.52 IC1.33
ESP_UART3_TX  (via drill 0.33)
  Top 0.152: IC5.34 31.73,33.16 31.11,32.54 26.35,32.54 v26.19,32.38
  Bottom 0.152: IC1.30 22.75,31.64 23.49,32.38 24.29,32.38 24.92,31.75 25.56,31.75 v26.19,32.38
FAN  (via drill 0.33)
  Top 0.152: v20.88,20.32 20.88,20.24 21.91,19.21 24.13,19.21 25.72,17.62 v25.72,15.4
  Bottom 0.152: v25.72,15.4 TP1.TP R14.1 | IC1.58 19.25,19.73 19.84,20.32 v20.88,20.32
GND  (via drill 0.33, 2.1 pad 4)
  Top 0.508: 35.72,34.29 35.72,37.46 | 35.72,47.94 35.72,51.28 | 21.75,47.94 21.75,51.28
  Bottom 0.152: v16.99,20.64 16.75,20.4 16.75,20 | IC1.26 20.75,29.01 21.27,29.05 21.27,29.23 21.26,30.8 | IC1.63 16.75,20.25 16.99,20.48 18.57,20.48 18.12,20.3
  Bottom 0.254: 20.75,30.8 20.75,29.37 | 21.26,30.8 21.26,29.37
  other vias: 33.66,17.14 6.35,29.21 4.45,51.59 6.35,51.59 8.26,51.59 10.16,51.59 12.06,51.59 13.97,51.59 15.88,51.59 17.78,51.59 19.37,51.59 20.64,51.59 6.99,57.78 6.99,56.52 6.99,55.24 6.99,53.98 8.26,53.18 9.53,53.18 13.34,53.18 14.61,53.18 15.88,53.98 15.88,57.78 15.88,56.52 15.88,55.24 10.79,53.18 12.06,53.18 24.13,57.78 24.13,56.52 24.13,55.24 24.13,53.98 25.4,53.18 26.67,53.18 27.94,53.18 29.21,53.18 30.48,53.18 31.75,53.18 33.02,57.78 33.02,56.52 33.02,55.24 33.02,53.98 23.65,49.69 28.26,49.69 20.64,48.58 19.37,48.58 31.59,49.69 34.45,45.09 4.45,49.53 4.45,46.83 4.45,44.93 34.45,37.78 2.38,34.61 5.56,42.7 6.99,41.27 1.11,34.61 14.61,36.04 24.13,27.78 19.21,25.56 18.57,22.7 16.35,22.7 16.35,27.78 15.24,30.64 13.18,29.05 6.99,24.45 8.57,21.43 15.4,18.26 13.18,17.78 26.67,29.21 27.15,20.8 22.38,13.18 15.56,13.34 19.68,13.34 25.56,13.18 8.57,14.29 20.32,28.97 16.35,25.24 22.7,22.7 30,25.08 10.64,7.94 3.81,7.94 29.84,3.02 29.84,4.45 29.84,6.67 14.45,6.83 23.81,3.02 25.4,4.45 25.4,6.67 34.45,42.55 31.59,39.85 23.49,42.39 23.49,37.78 17.3,36.04 17.3,37.62 5.56,33.18 7.3,32.07 8.57,41.27 7.94,34.45 8.57,37.15 5.56,35.72 9.37,44.93 16.67,42.23 14.61,37.62 16.67,39.69 14.61,41.27 30.32,42.55 29.69,39.85 34.45,40.16 24.53,31.12 22.7,25.56 20.16,21.11 14.61,32.7 32.86,29.53 21.27,3.02 18.73,3.02 13.18,16.03 21.43,10.64 14.45,8.89 4.92,17.78 4.92,14.29 34.61,32.38 22.62,28.97 18.89,33.34 20.32,27.15 23.49,36.04 13.49,45.88 13.49,47.31 38.1,36.67 9.37,46.83 13.02,33.18 22.22,51.59 24.13,51.59 26.04,51.59 27.94,51.59 29.84,51.59 31.75,51.59 33.66,51.59 35.56,51.59 34.45,44.29 31.59,45.09 22.54,45.09 24.76,45.09 26.99,45.09 29.21,45.09 27.3,36.04 34.45,36.04
  pour Bottom (isolate 0.203, rank 6): -0.64,59.05 40.64,59.05 40.64,-0.32 -0.64,-0.32
  pour Top (isolate 0.203, rank 6): -0.64,59.05 40.64,59.05 40.64,-0.32 -0.64,-0.32
JRPIN1_UART5_RX
  Bottom 0.152: IC1.55 20.75,17.74 20.16,17.14 20.16,15.24 20.48,14.92 20.48,7.78 20.8,7.46 20.8,5.08 20,4.29 PH-BOTCONMAIN.4
JRPIN5_UART2_RX
  Bottom 0.152: IC1.57 19.75,18.16 19.05,17.46 18.41,17.46 17.62,16.67 17.62,14.13 16.83,13.34 16.83,12.23 | 16.83,12.23 D1.C | 16.83,12.23 16.83,9.68 | 16.83,9.68 16.83,7.3 17.46,6.67 PH-BOTCONMAIN.5 | R5.2 16.83,9.68
LED1  (via drill 0.33)
  Top 0.152: R2.1 27.3,16.51 24.29,19.53 22.38,19.53 21.83,20.08 v21.83,20.32
  Bottom 0.152: IC1.54 21.25,19.82 21.75,20.32 v21.83,20.32
LED2  (via drill 0.33)
  Top 0.152: R3.1 28.75,15.4 28.89,15.4 24.13,20.16 v22.7,20.16
  Bottom 0.152: v22.7,20.16 22.75,20.05 IC1.51
LED3  (via drill 0.33)
  Top 0.152: v16.51,26.51 18.41,26.51 18.57,26.35 23.18,26.35 24.45,25.08 24.45,20.32 28.57,16.19 29.7,16.19 R4.1
  Bottom 0.152: IC1.12 15.71,26.52 v16.51,26.51
N$2
  Bottom 0.152: T1.1 33.02,11.43 32.07,12.38 31.59,12.38 30.8,13.18 30,13.18 | R15.2 29.38,12.56 30,13.18 | 30,13.18 30,14.11 R14.2
N$4
  Top 0.152: R2.2 27.3,13.34 27.94,12.7 LED1.A
N$5
  Bottom 0.152: IC1.7 12.81,24.02 11.43,25.4 10.78,25.4 C4.1
N$8
  Top 0.152: R3.2 28.91,13.64 29.84,12.7 LED2.A
N$9
  Top 0.152: LED3.A 31.75,12.7 30.48,13.97 R4.2
N$12
  Bottom 0.152: IC1.5 12.38,23.02 11.91,22.54 11.91,22.07 11.43,21.59 10.72,21.59 Q1.3
N$14
  Bottom 0.152: IC1.6 12.04,23.52 11.75,23.81 10.72,23.81 Q1.1
OLED_I2C3_SCL  (via drill 0.33)
  Top 0.152: 18.73,18.57 18.73,20.8 20.95,23.02 21.43,23.02 v22.22,23.81 | 18.73,18.57 PH-OLED.2 | R7.1 18.73,18.57
  Bottom 0.152: IC1.42 22.43,24.02 v22.22,23.81
OLED_I2C3_SDA  (via drill 0.33)
  Top 0.152: v21.27,23.81 18.08,20.62 R6.1 17.94,19.68 17.3,19.05 17.3,17.14 PH-OLED.1
  Bottom 0.152: IC1.41 21.97,24.52 v21.27,23.81
POS_CENTER  (via drill 0.33)
  Top 0.152: v13.02,20.64 12.38,20 12.38,15.4 16.19,11.59 16.99,11.59 17.94,12.54 18.73,12.54 20.48,10.79 20.48,10.32 19.68,9.53 18.73,9.53 SW1.2
  Bottom 0.152: IC1.2 13.42,21.52 13.02,21.11 v13.02,20.64
POS_DOWN  (via drill 0.33)
  Top 0.152: v12.86,25.88 12.7,25.72 12.7,23.18 13.34,22.54 13.34,21.91 12.06,20.64 10.46,20.64 R12.2 8.89,19.07 8.89,18.1 9.37,17.62 R13.1 9.37,16.99 10.16,16.19 10.16,15.4 10.48,15.08 10.79,15.08 15.72,10.16 15.72,9.53 17.46,7.78 17.94,7.78 18.41,8.25 19.68,8.25 21.11,6.83 21.11,5.08 SW1.6
  Bottom 0.152: IC1.10 13.22,25.52 v12.86,25.88
POS_LEFT
  Top 0.152: SW1.3 16.91,9.37 16.67,9.53 16.19,10 16.19,10.16 10.95,15.4 R11.2 10.95,16.03 10.16,16.83 10.16,17.78 9.68,18.26 R12.1
POS_RIGHT
  Top 0.152: R10.2 11.27,17.94 10.95,17.62 R11.1 11.75,16.35 11.75,15.08 16.19,10.64 16.59,10.64 18.49,8.73 19.84,8.73 21.43,7.14 23.18,7.14 23.81,6.51 23.81,6.42 SW1.4
POS_UP
  Top 0.152: R10.1 12.06,19.07 12.06,15.24 16.19,11.11 16.99,11.11 17.62,11.75 18.26,11.75 18.88,11.12 SW1.1
RTS  (via drill 0.33)
  Top 0.152: PH-CON2B.1 11.51,25.72 v12.38,26.59
  Bottom 0.152: IC1.11 13.67,26.02 13.1,26.59 v12.38,26.59
SER_UART4_RX  (via drill 0.33)
  Top 0.152: PH-BOTCONMAIN.2 26.35,2.54 26.35,7.14 26.04,7.46 26.04,10.64 22.38,14.29 22.38,16.67 v21.43,17.62
  Bottom 0.152: IC1.53 21.75,17.94 v21.43,17.62
SER_UART4_TX  (via drill 0.33)
  Top 0.152: PH-BOTCONMAIN.1 26.67,2.22 26.67,7.3 26.35,7.62 26.35,10.79 22.7,14.45 22.7,16.83 22.38,17.14 v22.38,17.94
  Bottom 0.152: IC1.52 22.25,18.07 v22.38,17.94
SPI1_CS  (via drill 0.33)
  Top 0.152: v11.43,35.08 v11.43,39.05
  Bottom 0.152: IC1.14 12.81,27.52 11.27,29.05 11.27,33.02 11.91,33.66 11.91,34.61 v11.43,35.08 | 4.13,40.96 4.29,40.96 4.45,40.8 6.35,40.8 7.78,39.37 11.11,39.37 v11.43,39.05
  Bottom 0.406: IC2.6 4.13,40.96
SPI1_MISO
  Bottom 0.152: IC1.20 17.75,31.94 15.72,33.97 15.08,33.97 10.32,38.73 6.19,38.73 4.6,37.15 IC2.3
SPI1_MOSI
  Bottom 0.152: IC1.21 18.25,31.91 15.72,34.45 15.08,34.45 10.48,39.05 5.87,39.05 5.24,38.42 IC2.4
SPI1_SCK  (via drill 0.33)
  Top 0.152: v6.35,39.69 v7.94,38.1
  Bottom 0.152: IC1.19 17.25,31.96 15.72,33.5 15.08,33.5 10.48,38.1 v7.94,38.1 | v6.35,39.69 IC2.5
SPI2_CS  (via drill 0.33)
  Top 0.152: v25.56,37.15 25.56,38.42 v23.49,40.48
  Bottom 0.152: v23.49,40.48 22.54,40.48 22.07,40.96 IC3.6 | v25.56,37.15 25.56,33.97 24.61,33.02 23.18,33.02 21.91,31.75 20.32,31.75 19.75,31.18 IC1.24
SPI2_MISO
  Bottom 0.152: IC1.36 27.49,27.02 29.84,29.37 29.84,37.62 28.57,38.89 23.49,38.89 21.75,37.15 IC3.3
SPI2_MOSI
  Bottom 0.152: IC1.37 27.47,26.52 30.16,29.21 30.16,37.78 28.73,39.21 23.18,39.21 22.38,38.42 IC3.4
SPI2_SCK  (via drill 0.33)
  Top 0.152: v28.26,38.26 v26.67,39.85
  Bottom 0.152: IC1.35 27.51,27.52 29.53,29.53 29.53,37.15 28.42,38.26 v28.26,38.26 | v26.67,39.85 25.56,39.85 25.4,39.69 IC3.5
SWCLK
  Bottom 0.152: IC1.50 23.25,18.18 23.81,17.62 24.61,17.62 25.08,17.14 28.1,17.14 PH-SWD.2
SWDIO
  Bottom 0.152: IC1.49 23.75,18.32 24.13,17.94 24.76,17.94 25.24,17.46 27.94,17.46 29.05,18.57 29.05,20.64 PH-SWD.4
SX1_BUSY
  Bottom 0.152: IC2.12 18.57,39.69 18.41,39.53 17.62,39.53 15.88,37.78 15.88,34.77 18.75,31.89 IC1.22
SX1_DIO
  Bottom 0.152: IC2.13 18.57,38.42 18.41,38.58 17.14,38.58 16.19,37.62 16.19,34.92 19.25,31.87 IC1.23
SX1_RESET  (via drill 0.33)
  Top 0.152: v16.67,40.96 15.72,40.01 15.72,32.7 v16.51,31.75
  Bottom 0.152: IC1.18 16.75,31.51 v16.51,31.75 | IC2.11 v16.67,40.96
SX1_RX_EN  (via drill 0.33)
  Top 0.152: v11.27,34.13 10.79,34.61 v10.79,41.27
  Bottom 0.152: v11.27,34.13 10.95,33.81 10.95,28.89 12.7,27.15 13.18,27.15 13.31,27.02 IC1.13 | v10.79,41.27 8.57,43.5 IC2.8
SX1_TX_EN  (via drill 0.33)
  Top 0.152: v15.56,31.75 15.56,32.38 15.4,32.54 15.4,42.23 v16.67,43.5
  Bottom 0.152: IC2.9 v16.67,43.5 | IC1.17 16.25,31.05 v15.56,31.75
SX2_BUSY
  Bottom 0.152: IC1.45 27.44,22.52 27.78,22.86 27.78,24.92 31.43,28.58 31.43,36.51 34.29,39.37 35.88,39.37 35.88,39.69 IC3.12
SX2_DIO
  Bottom 0.152: IC1.46 27.41,22.02 28.1,22.7 28.1,24.77 31.75,28.42 31.75,36.35 33.97,38.58 35.4,38.58 35.56,38.42 IC3.13
SX2_RESET
  Bottom 0.152: IC1.40 27.4,25.02 31.11,28.73 31.11,38.26 33.81,40.96 IC3.11
SX2_RX_EN  (via drill 0.33)
  Top 0.152: v23.49,43.5 25.4,41.59 25.4,40.16 v27.3,38.26
  Bottom 0.152: v23.49,43.5 IC3.8 | IC1.34 27.54,28.02 29.21,29.69 29.21,36.83 28.57,37.46 28.1,37.46 v27.3,38.26
SX2_TX_EN
  Bottom 0.152: IC1.39 27.42,25.52 30.8,28.89 30.8,40.01 34.29,43.5 IC3.9
UART2_TX
  Bottom 0.152: IC1.56 20.25,17.87 19.84,17.46 19.84,15.24 18.73,14.13 D1.A
USB_UART1_RX  (via drill 0.33)
  Top 0.152: v27.15,23.18 27.78,23.81 33.66,23.81 PH-CON2.2
  Bottom 0.152: IC1.44 26.98,23.02 v27.15,23.18
USB_UART1_TX  (via drill 0.33)
  Top 0.152: v27.15,24.13 32.7,24.13 PH-CON2.1
  Bottom 0.152: IC1.43 26.53,23.52 v27.15,24.13

### Text on the board
tNames: A1 | A2 | v0.42 / rev00 | mLRS | DBG | 3.3V | Tx | Rx | GND | (c) www.olliw.eu | 5V | RTS | U1-TX | U1-RX | Buz | DTR | Gnd | G | SWD | G | OLED | BOOT | BUT | SDA | SCL | 3.3 | GND | mLRS | (c) olliw | G | SRx | STx
bNames: A1 | A2 | E28 #1 | E28 #2 | SWD | 3.3V | G | 1 | GND | JRpin5 | JRp | 3.3V | SRx | STx